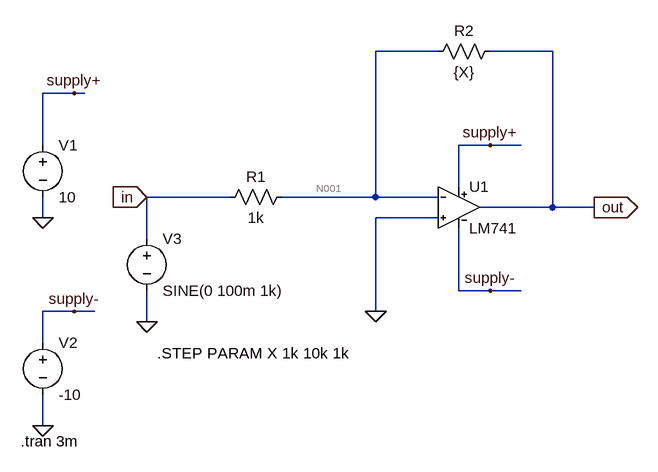
[diagram p0: schematic op_parameter.asc]
op_parameter.asc, the LTspice schematic file:
Version 4
SHEET 1 1016 680
WIRE 672 -80 576 -80
WIRE 848 -80 752 -80
WIRE 112 -16 64 -16
WIRE 128 -16 112 -16
WIRE 64 64 64 -16
WIRE 752 64 704 64
WIRE 800 64 752 64
WIRE 704 128 704 64
WIRE 352 144 224 144
WIRE 576 144 576 -80
WIRE 576 144 432 144
WIRE 672 144 576 144
WIRE 848 160 848 -80
WIRE 848 160 736 160
WIRE 912 160 848 160
WIRE 64 176 64 144
WIRE 672 176 576 176
WIRE 224 208 224 144
WIRE 704 288 704 192
WIRE 752 288 704 288
WIRE 800 288 752 288
WIRE 112 320 64 320
WIRE 144 320 112 320
WIRE 576 320 576 176
WIRE 224 336 224 288
WIRE 64 368 64 320
WIRE 64 496 64 448
FLAG 64 176 0
FLAG 64 496 0
FLAG 224 336 0
FLAG 112 -16 supply+
FLAG 112 320 supply-
FLAG 224 144 in
IOPIN 224 144 In
FLAG 912 160 out
IOPIN 912 160 Out
FLAG 752 64 supply+
FLAG 752 288 supply-
FLAG 576 320 0
SYMBOL voltage 64 48 R0
WINDOW 123 0 0 Left 2
WINDOW 39 0 0 Left 2
SYMATTR InstName V1
SYMATTR Value 10
SYMBOL voltage 64 352 R0
WINDOW 123 0 0 Left 2
WINDOW 39 0 0 Left 2
SYMATTR InstName V2
SYMATTR Value -10
SYMBOL voltage 224 192 R0
WINDOW 123 0 0 Left 2
WINDOW 39 0 0 Left 2
SYMATTR InstName V3
SYMATTR Value SINE(0 100m 1k)
SYMBOL res 336 160 R270
WINDOW 0 32 56 VTop 2
WINDOW 3 0 56 VBottom 2
SYMATTR InstName R1
SYMATTR Value 1k
SYMBOL LM741 704 96 R0
SYMATTR InstName U1
SYMBOL res 656 -64 R270
WINDOW 0 32 56 VTop 2
WINDOW 3 0 56 VBottom 2
SYMATTR InstName R2
SYMATTR Value {X}
TEXT 240 384 Left 2 !.STEP PARAM X 1k 10k 1k
TEXT 30 520 Left 2 !.tran 3m

The netlist it stands for:
* op_parameter.asc
V1 supply+ 0 10
V2 supply- 0 -10
V3 in 0 SINE(0 100m 1k)
R1 in N001 1k
XU1 0 N001 supply+ supply- out LM741  ; pins In+ In- V+ V- OUT
R2 N001 out {X}
.STEP PARAM X 1k 10k 1k
.tran 3m
.lib LM741.lib
.backanno
.end

* Results of the author's LTspice run, read from the files saved beside the schematic
* Operating Point (first step), zero values left out:
*   x = 1 k
*   V(supply+) = 10 V
*   V(supply-) = -10 V
*   V(n001) = 1 mV
*   V(out) = 2.102 mV
*   I(R2) = -1.102 µA
*   I(R1) = -1 µA
*   I(V3) = 1 µA
*   I(V2) = 1.576 mA
*   I(V1) = -1.577 mA
*   Ix(u1:1) = 57.86 nA
*   Ix(u1:2) = 101.9 nA
*   Ix(u1:99) = 1.577 mA
*   Ix(u1:50) = -1.576 mA
*   Ix(u1:28) = -1.102 µA
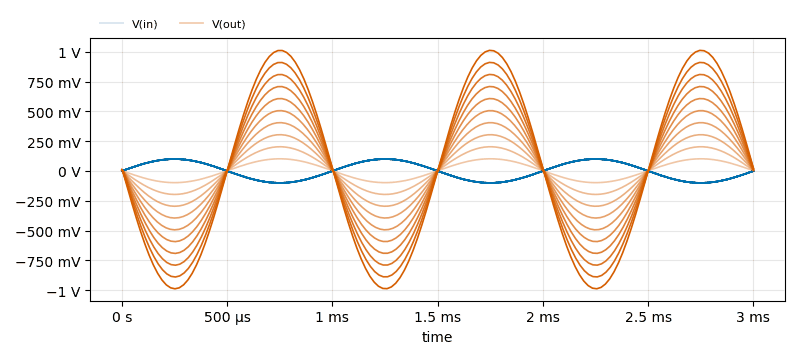
[diagram p1: Transient Analysis of op_parameter.asc, plotted from the saved traces]
* Transient Analysis, 10 runs:
*   V(in) [x=1000]: min -99.93 mV, max 99.93 mV, average 30.28 nV, rms 70.71 mV, last 0 V
*   V(in) [x=2000]: min -99.91 mV, max 100 mV, average 24.52 nV, rms 70.71 mV, last 0 V
*   V(in) [x=3000]: min -99.9 mV, max 100 mV, average 0 V, rms 70.71 mV, last 0 V
*   V(in) [x=4000]: min -99.91 mV, max 100 mV, average 0 V, rms 70.71 mV, last 0 V
*   V(in) [x=5000]: min -99.9 mV, max 100 mV, average 26.94 nV, rms 70.71 mV, last 0 V
*   V(in) [x=6000]: min -99.95 mV, max 99.97 mV, average -117.9 nV, rms 70.71 mV, last 0 V
*   V(in) [x=7000]: min -99.95 mV, max 99.97 mV, average -76.05 nV, rms 70.71 mV, last 0 V
*   V(in) [x=8000]: min -99.96 mV, max 99.97 mV, average -78.58 nV, rms 70.71 mV, last 0 V
*   V(out) [x=1000]: min -97.81 mV, max 102 mV, average 2.102 mV, rms 70.74 mV, last 2.339 mV
*   V(out) [x=2000]: min -196.8 mV, max 203 mV, average 3.204 mV, rms 141.4 mV, last 3.86 mV
*   V(out) [x=3000]: min -295.7 mV, max 304 mV, average 4.305 mV, rms 212.1 mV, last 5.581 mV
*   V(out) [x=4000]: min -394.5 mV, max 405.1 mV, average 5.407 mV, rms 282.9 mV, last 7.503 mV
*   V(out) [x=5000]: min -493.4 mV, max 506.1 mV, average 6.508 mV, rms 353.6 mV, last 9.626 mV
*   V(out) [x=6000]: min -592.2 mV, max 607.1 mV, average 7.61 mV, rms 424.3 mV, last 11.95 mV
*   V(out) [x=7000]: min -691.1 mV, max 708.1 mV, average 8.711 mV, rms 495 mV, last 14.47 mV
*   V(out) [x=8000]: min -789.9 mV, max 809.1 mV, average 9.811 mV, rms 565.7 mV, last 17.2 mV